# EasyEDA Pro project ProPrj_Iris One_2026-02-21.epro

# Schematic Iris One
Board Name: IrisV1.0; Create Date: 2026-02-19; Page Name: P1; Project Name: Iris One; Schematic Name: Iris One; Update Date: 2026-02-20; Company: root://workspace; Drawn: NullByte; Page Size: A4; Version: V1.0
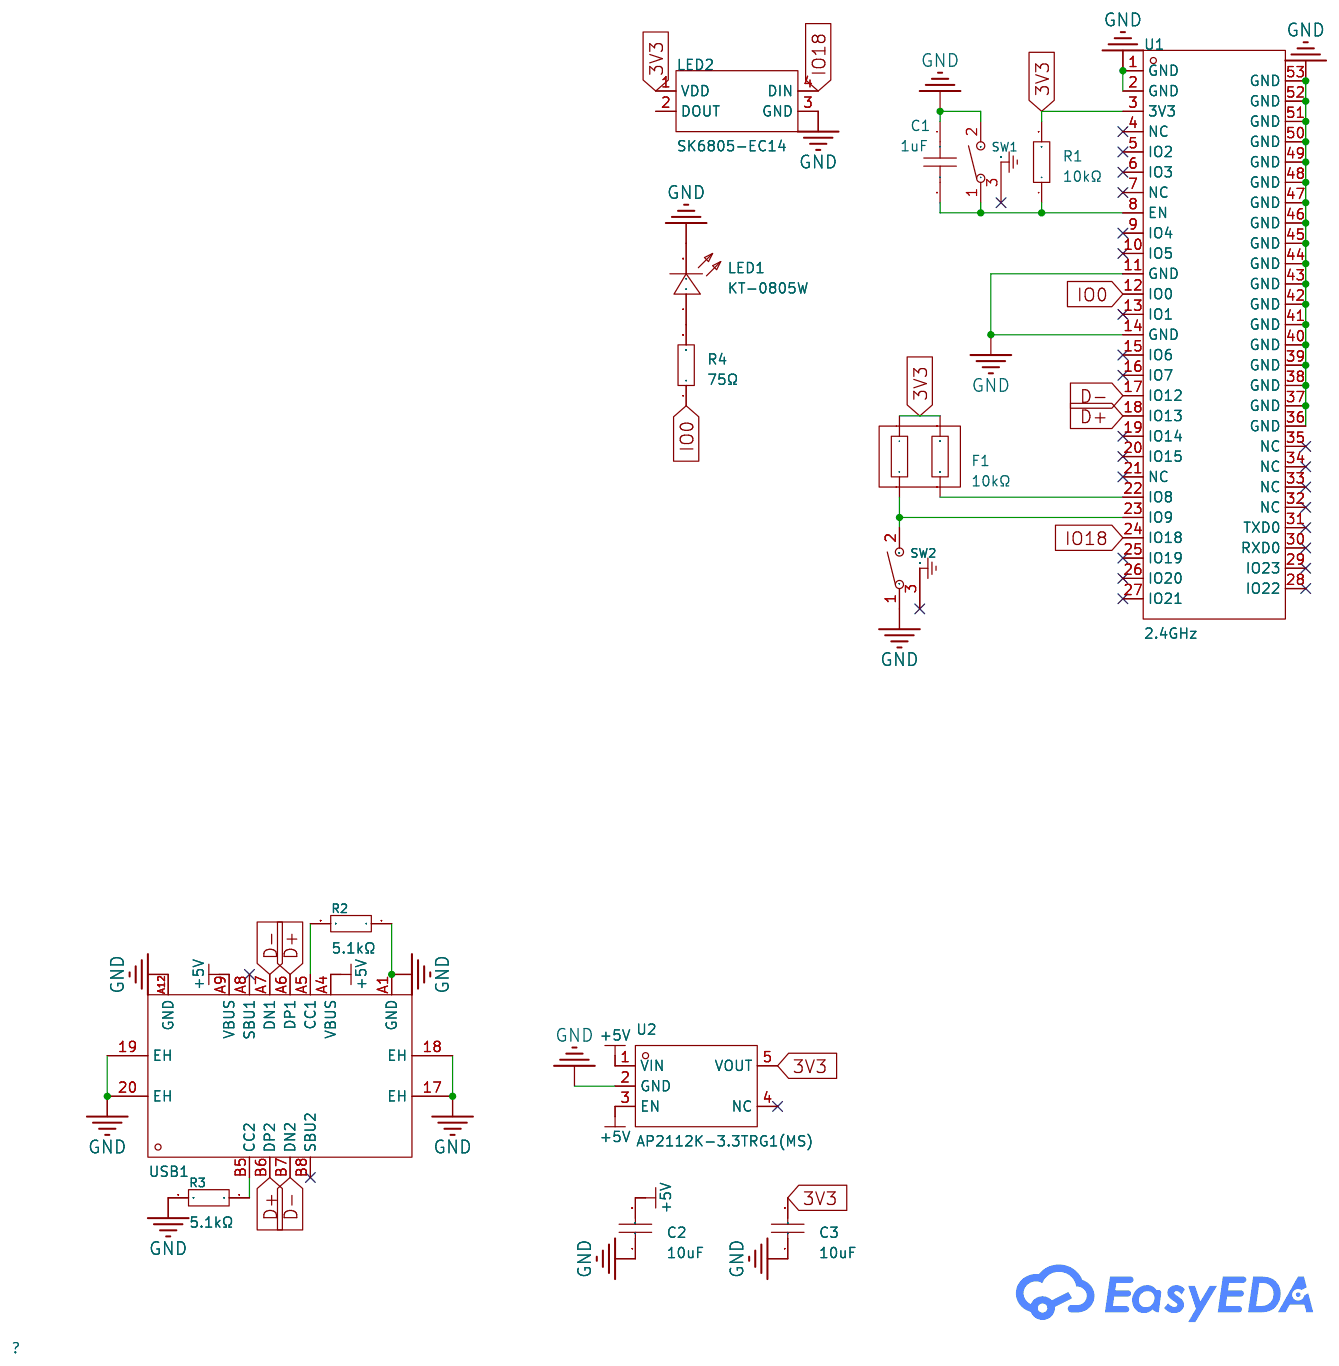
[diagram p0: schematic sheet]

## Parts
C1  1uF  [C0402]
C2  10uF  [C0402]
C3  10uF  [C0402]
F1  10kΩ  [RES-ARRAY-SMD_0404-4P-L1.0-W1.0-BL]
LED1  KT-0805W  [LED0805-R-RD]
LED2  SK6805-EC14  [LED-SMD_4P-L1.4-W1.4-TL]
R1  10kΩ  [R0402]
R2  5.1kΩ  [R0402]
R3  5.1kΩ  [R0402]
R4  75Ω  [R0402]
SW1  SKTDLHE010  [KEY-SMD_SKTDLHE010]
SW2  SKTDLHE010  [KEY-SMD_SKTDLHE010]
U1  2.4GHz  [WIFIM-SMD_61P-L16.6-W13.2-P0.80-ESP32-C6-MINI-1-N4]
U2  AP2112K-3.3TRG1(MS)  [SOT-23-5_L2.9-W1.6-P0.95-LS2.7-BR]
USB1  TYPE-C 16P QTGM027  [USB-C-SMD_TYPE-C-16P-QTGM027]

## Library data of the parts
C1 = CL05A105KA5NQNC: Capacitance:1uF Tolerance:±10% Tolerance:±10% Voltage Rating:25V Temperature Coefficient:X5R; LCSC Part Name: 1uF ±10% 25V; Supplier Part: C52923; Manufacturer: SAMSUNG(三星); Supplier Footprint: 0402; JLCPCB Part Class: Basic Part; Datasheet: https://item.szlcsc.com/datasheet/CL05A105KA5NQNC/53938.html; Supplier: LCSC; Tolerance: ±10%; Voltage Rating: 25V; Temperature Coefficient: X5R
C2 C3 = CL05A106MQ5NUNC: Capacitance:10uF Tolerance:±20% Tolerance:±20% Voltage Rating:6.3V Temperature Coefficient:X5R; LCSC Part Name: 10uF ±20% 6.3V; Supplier Part: C15525; Manufacturer: SAMSUNG(三星); Supplier Footprint: 0402; JLCPCB Part Class: Basic Part; Datasheet: https://item.szlcsc.com/datasheet/CL05A106MQ5NUNC/16204.html; Supplier: LCSC; Tolerance: ±20%; Voltage Rating: 6.3V; Temperature Coefficient: X5R
F1 = YC122-JR-0710KL: Number of Resistors: Resistance: Tolerance:±5% Tolerance:±5% Power(Watts): Temperature Coefficient:±200ppm/℃ Temperature Coefficient:±200ppm/℃ Number of Pins:; LCSC Part Name: 10kΩ ±5%; Supplier Part: C695179; Manufacturer: YAGEO(国巨); Supplier Footprint: 0402x2; JLCPCB Part Class: Extended Part; Datasheet: https://atta.szlcsc.com/upload/public/pdf/source/20200630/C695179_C01B8AD03C65079234DFC6C85CDBB06F.pdf; Supplier: LCSC; Tolerance: ±5%; Temperature Coefficient: ±200ppm/℃
LED1 = KT-0805W: LCSC Part Name: 0805 白灯 高亮; Supplier Part: C34499; Manufacturer: KENTO; Supplier Footprint: 0805; JLCPCB Part Class: Basic Part; Datasheet: https://atta.szlcsc.com/upload/public/pdf/source/20221124/DAA20402FFC1FB071B8B6797757426FE.pdf; Supplier: LCSC
LED2 = SK6805-EC14_C2909055: LCSC Part Name: RGB三色; Supplier Part: C2909055; Manufacturer: 欧思科光电; Supplier Footprint: SMD,1.4x1.4mm; JLCPCB Part Class: Extended Part; Datasheet: https://atta.szlcsc.com/upload/public/pdf/source/20220216/66E0AA6A2A862BC6ACA495BCDA772BF7.pdf; Supplier: LCSC
R1 = 0402WGF1002TCE: Type:Thick Film Resistor Resistance:10kΩ Tolerance:±1% Tolerance:±1% Power(Watts):62.5mW Voltage-Supply(Max):50V Temperature Coefficient:±100ppm/℃ Temperature Coefficient:±100ppm/℃ Operating Temperature:-55℃~+155℃ Operating Temperature:-55℃~+155℃; LCSC Part Name: 10kΩ ±1% 62.5mW 厚膜电阻; Supplier Part: C25744; Manufacturer: UNI-ROYAL(厚声); Supplier Footprint: 0402; JLCPCB Part Class: Basic Part; Datasheet: https://item.szlcsc.com/datasheet/0402WGF1002TCE/26487.html; Supplier: LCSC; Type: Thick Film Resistor; Tolerance: ±1%; Power(Watts): 62.5mW; Voltage-Supply(Max): 50V; Temperature Coefficient: ±100ppm/℃; Operating Temperature: -55℃~+155℃
R2 R3 = 0402WGF5101TCE: Type:Thick Film Resistor Resistance:5.1kΩ Tolerance:±1% Tolerance:±1% Power(Watts):62.5mW Voltage-Supply(Max):50V Temperature Coefficient:±100ppm/℃ Temperature Coefficient:±100ppm/℃ Operating Temperature:-55℃~+155℃ Operating Temperature:-55℃~+155℃; LCSC Part Name: 5.1kΩ ±1% 62.5mW 厚膜电阻; Supplier Part: C25905; Manufacturer: UNI-ROYAL(厚声); Supplier Footprint: 0402; JLCPCB Part Class: Basic Part; Datasheet: https://item.szlcsc.com/datasheet/0402WGF5101TCE/26648.html; Supplier: LCSC; Type: Thick Film Resistor; Tolerance: ±1%; Power(Watts): 62.5mW; Voltage-Supply(Max): 50V; Temperature Coefficient: ±100ppm/℃; Operating Temperature: -55℃~+155℃
R4 = 0402WGF750JTCE: Type:Thick Film Resistor Resistance:75Ω Tolerance:±1% Tolerance:±1% Power(Watts):62.5mW Voltage-Supply(Max):50V Temperature Coefficient:±100ppm/℃ Temperature Coefficient:±100ppm/℃ Operating Temperature:-55℃~+155℃ Operating Temperature:-55℃~+155℃; LCSC Part Name: 75Ω ±1% 62.5mW 厚膜电阻; Supplier Part: C25133; Manufacturer: UNI-ROYAL(厚声); Supplier Footprint: 0402; JLCPCB Part Class: Extended Part; Datasheet: https://item.szlcsc.com/datasheet/0402WGF750JTCE/25876.html; Supplier: LCSC; Type: Thick Film Resistor; Tolerance: ±1%; Power(Watts): 62.5mW; Voltage-Supply(Max): 50V; Temperature Coefficient: ±100ppm/℃; Operating Temperature: -55℃~+155℃
SW1 SW2 = SKTDLHE010: Circuit:SPST Actuator Style:Rectangle button Mounting Style:卧贴 With Lamp:- Mechanical Life:-; Supplier Part: C380198; Manufacturer: ALPSALPINE(阿尔卑斯阿尔派); Supplier Footprint: SMD; JLCPCB Part Class: Extended Part; Datasheet: https://atta.szlcsc.com/upload/public/pdf/source/20200409/C380198_178C729B1AFCBF15D3CDD9052567B65D.pdf; Supplier: LCSC; Circuit: SPST; Actuator Style: Rectangle button; Mounting Style: 卧贴
U1 = ESP32-C6-MINI-1-N4: Utilized IC / Part:ESP32-C6FH4 Interface Type:I2C；GPIO；UART；SPI；I2S Frequency:2.4GHz Antenna Type:On-board PCB Antenna Output Power:20.5dBm Output Power:20.5dBm Voltage - Supply:3V~3.6V Voltage - Supply:3V~3.6V Receive  Current:78mA Send  Current:382mA Se; Supplier Part: C5736265; Manufacturer: ESPRESSIF(乐鑫); Supplier Footprint: SMD-53P; JLCPCB Part Class: Extended Part; Datasheet: https://item.szlcsc.com/datasheet/ESP32-C6-MINI-1-N4/6661848.html; Supplier: LCSC; Utilized IC / Part: ESP32-C6FH4; Interface Type: I2C；GPIO；UART；SPI；I2S; Antenna Type: On-board PCB Antenna; Output Power: 20.5dBm; Voltage - Supply: 3V~3.6V; Receive  Current: 78mA; Send  Current: 382mA; Sensitivity: -99.2dBm; Operating Temperature: -40℃~+85℃
U2 = AP2112K-3.3TRG1(MS): Output Type:Fixed Voltage - Supply:6V Output Voltage:3.3V Output Voltage:3.3V Output Current:600mA Power Supply Rejection Ratio (PSRR):75dB@(1kHz) Voltage Dropout:- standby current:2uA Noise:- Features:Automatic Discharge Function；Low ESR；Overheat protect; Supplier Part: C22365427; Manufacturer: MSKSEMI(美森科); Supplier Footprint: SOT-23-5; JLCPCB Part Class: Extended Part; Datasheet: https://item.szlcsc.com/datasheet/AP2112K-3.3TRG1(MS)/23832169.html; Supplier: LCSC; Output Type: Fixed; Voltage - Supply: 6V; Output Voltage: 3.3V; Output Current: 600mA; Power Supply Rejection Ratio (PSRR): 75dB@(1kHz); standby current: 2uA; Features: Automatic Discharge Function；Low ESR；Overheat protection；Overcurrent Protection；With ability; Operating Temperature: -40℃~+125℃@(Tj); Output Configuration: Positive electrode; Number of Outputs: 1
USB1 = TYPE-C 16P QTGM027: Connector Type:Type-C Protocol Standard:USB 3.1 Gender:Female Mounting Type:Surface Mount, Right Angle Number of Contacts:16P Number of Ports:1 Current Rating-Power:3A Voltage Rating:20V Connect-Disconnect Life:5,000 times Detection color:Black Operating; LCSC Part Name: 16P卧贴母座; Supplier Part: C2681552; Manufacturer: SHOU HAN(首韩); Supplier Footprint: SMD; JLCPCB Part Class: Extended Part; Datasheet: https://item.szlcsc.com/datasheet/TYPE-C%252016P%2520QTGM027/2774895.html; Supplier: LCSC; Connector Type: Type-C; Protocol Standard: USB 3.1; Gender: Female; Mounting Type: Surface Mount, Right Angle; Number of Contacts: 16P; Number of Ports: 1; Current Rating-Power: 3A; Voltage Rating: 20V; Connect-Disconnect Life: 5,000 times; Detection color: Black; Operating Temperature: -30℃~+80℃

## Nets
3V3: C3.2 F1.3 F1.4 LED2.1(VDD) R1.2 U1.3(3V3) U2.5(VOUT)
+5V: C2.2 U2.1(VIN) U2.3(EN) USB1.A4(VBUS) USB1.A9(VBUS)
GND: C1.1 C2.1 C3.1 LED1.2(K) LED2.3(GND) R2.1 R3.2 SW1.2 SW2.1 U1.1(GND) U1.2(GND) U1.11(GND) U1.14(GND) U1.36(GND) U1.37(GND) U1.38(GND) U1.39(GND) U1.40(GND) U1.41(GND) U1.42(GND) U1.43(GND) U1.44(GND) U1.45(GND) U1.46(GND) U1.47(GND) U1.48(GND) U1.49(GND) U1.50(GND) U1.51(GND) U1.52(GND) U1.53(GND) U2.2(GND) USB1.17(EH) USB1.18(EH) USB1.19(EH) USB1.20(EH) USB1.A1(GND) USB1.A12(GND)
D+: U1.18(IO13) USB1.A6(DP1) USB1.B6(DP2)
D-: U1.17(IO12) USB1.A7(DN1) USB1.B7(DN2)
IO0: R4.1 U1.12(IO0)
IO18: LED2.4(DIN) U1.24(IO18)
$1N9305: F1.2 U1.22(IO8)
$1N9321: F1.1 SW2.2 U1.23(IO9)
$1N9412: C1.2 R1.1 SW1.1 U1.8(EN)
$1N11906: R3.1 USB1.B5(CC2)
$1N11910: R2.2 USB1.A5(CC1)
$1N12514: LED1.1(A) R4.2

Not connected (* = marked no-connect by the designer): LED2 2(DOUT); SW1 3(GND)*; SW2 3(GND)*; U1 4(NC)* 5(IO2)* 6(IO3)* 7(NC)* 9(IO4)* 10(IO5)* 13(IO1)* 15(IO6)* 16(IO7)* 19(IO14)* 20(IO15)* 21(NC)* 25(IO19)* 26(IO20)* 27(IO21)* 28(IO22)* 29(IO23)* 30(RXD0)* 31(TXD0)* 32(NC)* 33(NC)* 34(NC)* 35(NC)*; U2 4(NC)*; USB1 A8(SBU1)* B8(SBU2)*

# Board PCB1
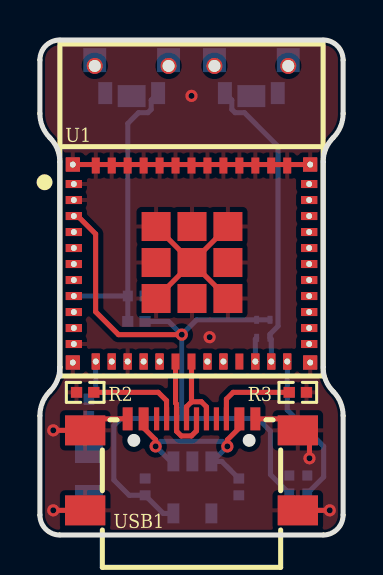
[diagram p1: board, top side]
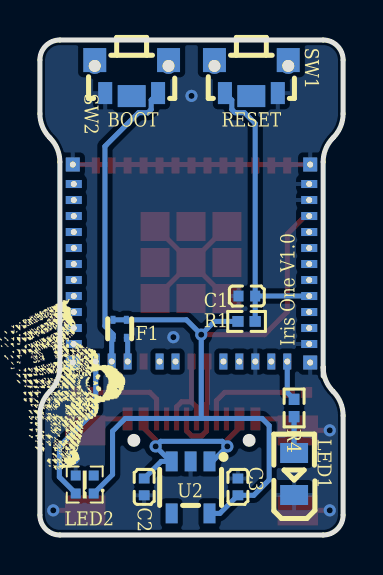
[diagram p2: board, bottom side, seen from below]

Outline 15.2 x 24.75 mm; copper layers: Top Layer, Bottom Layer. Coordinates in mm from the lower left corner of the outline.
Outline path: 1,8.39 arc(0.87,7.73) 0.5,7.18 arc(0.13,6.63) 0,5.97 0,1 arc(0.29,0.29) 1,0 14.2,0 arc(14.91,0.29) 15.2,1 15.2,5.97 arc(15.07,6.63) 14.7,7.18 arc(14.33,7.73) 14.2,8.39 14.2,18.66 arc(14.33,19.31) 14.7,19.86 arc(15.07,20.42) 15.2,21.07 15.2,23.75 arc(14.91,24.46) 14.2,24.75 1,24.75 arc(0.29,24.46) 0,23.75 0,21.07 arc(0.13,20.42) 0.5,19.86 arc(0.87,19.31) 1,18.66 1,8.39 ; 1,8.39 1,7.95
Stack: Top Layer 0.035mm / Dielectric1 1.51mm FR4 er 4.5 / Bottom Layer 0.035mm

## Design rules (mm)
template: JLCPCB Capability(Two Layers Board)
spacing copperThickness1oz (default): track to track 0.102, other pairs 0.152 to 0.3
spacing copperThickness2oz: track to track 0.203, other pairs 0.152 to 0.3
track width copperThickness1oz (default): min 0.127, default 0.254, max 2.54
track width copperThickness2oz: min 0.203, default 0.254, max 2.54
differential pair differentialPair (default): width min 0.127, default 0.254, max 2.54; gap min 0.152, default 0.152
via viaSize (default): diameter min 0.5, default 0.61, max 10; hole min 0.3, default 0.305, max 6.3

## Placement (name value [footprint] x y rotation side)
C1  1uF  [C0402]  4.83 11.95 180 bottom
C2  10uF  [C0402]  9.97 2.41 90 bottom
C3  10uF  [C0402]  5.27 2.41 270 bottom
F1  10kΩ  [RES-ARRAY-SMD_0404-4P-L1.0-W1.0-BL]  11.2 10.31 180 bottom
LED1  KT-0805W  [LED0805-R-RD]  2.46 3.05 90 bottom
LED2  SK6805-EC14  [LED-SMD_4P-L1.4-W1.4-TL]  12.95 2.53 0 bottom
NOREF  -  [Pad_e155]  3.6 8.67 90 top
NOREF#2  -  [Pad_e128]  1.7 12.75 0 top
NOREF#3  -  [Pad_e136]  13.5 15.15 0 top
NOREF#4  -  [Pad_e504]  13.55 8.62 0 top
NOREF#5  -  [Pad_e133]  13.5 17.55 0 top
NOREF#6  -  [Pad_e125]  1.7 15.15 0 top
NOREF#7  -  [Pad_e141]  13.5 11.15 0 top
NOREF#8  -  [Pad_e137]  13.5 14.35 0 top
NOREF#9  -  [Pad_e154]  4.4 8.67 90 top
NOREF#10  -  [Pad_e122]  1.7 17.55 0 top
NOREF#11  -  [Pad_e134]  13.5 16.75 0 top
NOREF#12  -  [Pad_e149]  8.4 8.67 90 top
NOREF#13  -  [Pad_e505]  1.65 8.62 0 top
NOREF#14  -  [Pad_e123]  1.7 16.75 0 top
NOREF#15  -  [Pad_e153]  5.2 8.67 90 top
NOREF#16  -  [Pad_e143]  13.5 9.55 0 top
NOREF#17  -  [Pad_e126]  1.7 14.35 0 top
NOREF#18  -  [Pad_e124]  1.7 15.95 0 top
NOREF#19  -  [Pad_e507]  13.55 18.52 0 top
NOREF#20  -  [Pad_e132]  1.7 9.55 0 top
NOREF#21  -  [Pad_e152]  6 8.67 90 top
NOREF#22  -  [Pad_e127]  1.7 13.55 0 top
NOREF#23  -  [Pad_e146]  11.6 8.67 270 top
NOREF#24  -  [Pad_e130]  1.7 11.15 0 top
NOREF#25  -  [Pad_e147]  10.8 8.67 90 top
NOREF#26  -  [Pad_e131]  1.7 10.35 0 top
NOREF#27  -  [Pad_e142]  13.5 10.35 0 top
NOREF#28  -  [Pad_e140]  13.5 11.95 0 top
NOREF#29  -  [Pad_e138]  13.5 13.55 0 top
NOREF#30  -  [Pad_e508]  1.65 18.52 0 top
NOREF#31  -  [Pad_e156]  2.8 8.67 90 top
NOREF#32  -  [Pad_e148]  9.2 8.67 90 top
NOREF#33  -  [Pad_e129]  1.7 11.95 0 top
NOREF#34  -  [Pad_e145]  12.4 8.67 90 top
NOREF#35  -  [Pad_e139]  13.5 12.75 0 top
NOREF#36  -  [Pad_e135]  13.5 15.95 0 top
R1  10kΩ  [R0402]  4.84 10.68 0 bottom
R2  5.1kΩ  [R0402]  2.27 7.13 0 top
R3  5.1kΩ  [R0402]  12.93 7.13 0 top
R4  75Ω  [R0402]  2.46 6.35 270 bottom
SW1  SKTDLHE010  [KEY-SMD_SKTDLHE010]  4.6 22.84 180 bottom
SW2  SKTDLHE010  [KEY-SMD_SKTDLHE010]  10.6 22.84 180 bottom
U1  2.4GHz  [WIFIM-SMD_61P-L16.6-W13.2-P0.80-ESP32-C6-MINI-1-N4]  7.6 13.57 0 top
U2  AP2112K-3.3TRG1(MS)  [SOT-23-5_L2.9-W1.6-P0.95-LS2.7-BR]  7.65 2.38 90 bottom
USB1  TYPE-C 16P QTGM027  [USB-C-SMD_TYPE-C-16P-QTGM027]  7.6 3.52 0 top

## Footprints (pads in the part's own frame, mm; a bottom-side part is the same pattern mirrored in y, then rotated)
C0402
  rect 0.5x0.54 smd: 1(-0.42,0) 2(0.42,0)
KEY-SMD_SKTDLHE010
  rect 0.7x1.1 smd: 1(-1.325,-0.75) 2(1.325,-0.75)
  round 0.8 hole 0.6: 3(-1.85,0.608) 3(1.85,0.608)
  rect 1.15x1.2 smd: 3(-1.85,0.9) 3(1.85,0.9)
  rect 1.4x1.1 smd: 3(0,-0.9)
LED0805-R-RD
  rect 1x1.399 smd: 1(1.05,0) 2(-1.05,0)
LED-SMD_4P-L1.4-W1.4-TL
  rect 0.5x0.5 smd: 1(-0.45,0.45) 2(-0.45,-0.45) 3(0.45,-0.45) 4(0.45,0.45)
Pad_e122
  rect 0.8x0.4 hole 0.3: 1(0,0)
Pad_e123
  rect 0.8x0.4 hole 0.3: 1(0,0)
Pad_e124
  rect 0.8x0.4 hole 0.3: 1(0,0)
Pad_e125
  rect 0.8x0.4 hole 0.3: 1(0,0)
Pad_e126
  rect 0.8x0.4 hole 0.3: 1(0,0)
Pad_e127
  rect 0.8x0.4 hole 0.3: 1(0,0)
Pad_e128
  rect 0.8x0.4 hole 0.3: 1(0,0)
Pad_e129
  rect 0.8x0.4 hole 0.3: 1(0,0)
Pad_e130
  rect 0.8x0.4 hole 0.3: 1(0,0)
Pad_e131
  rect 0.8x0.4 hole 0.3: 1(0,0)
Pad_e132
  rect 0.8x0.4 hole 0.3: 1(0,0)
Pad_e133
  rect 0.8x0.4 hole 0.3: 1(0,0)
Pad_e134
  rect 0.8x0.4 hole 0.3: 1(0,0)
Pad_e135
  rect 0.8x0.4 hole 0.3: 1(0,0)
Pad_e136
  rect 0.8x0.4 hole 0.3: 1(0,0)
Pad_e137
  rect 0.8x0.4 hole 0.3: 1(0,0)
Pad_e138
  rect 0.8x0.4 hole 0.3: 1(0,0)
Pad_e139
  rect 0.8x0.4 hole 0.3: 1(0,0)
Pad_e140
  rect 0.8x0.4 hole 0.3: 1(0,0)
Pad_e141
  rect 0.8x0.4 hole 0.3: 1(0,0)
Pad_e142
  rect 0.8x0.4 hole 0.3: 1(0,0)
Pad_e143
  rect 0.8x0.4 hole 0.3: 1(0,0)
Pad_e145
  rect 0.8x0.4 hole 0.3: 1(0,0)
Pad_e146
  rect 0.8x0.4 hole 0.3: 1(0,0)
Pad_e147
  rect 0.8x0.4 hole 0.3: 1(0,0)
Pad_e148
  rect 0.8x0.4 hole 0.3: 1(0,0)
Pad_e149
  rect 0.8x0.4 hole 0.3: 1(0,0)
Pad_e152
  rect 0.8x0.4 hole 0.3: 1(0,0)
Pad_e153
  rect 0.8x0.4 hole 0.3: 1(0,0)
Pad_e154
  rect 0.8x0.4 hole 0.3: 1(0,0)
Pad_e155
  rect 0.8x0.4 hole 0.3: 1(0,0)
Pad_e156
  rect 0.8x0.4 hole 0.3: 1(0,0)
Pad_e504
  rect 0.7x0.7 hole 0.3: 1(0,0)
Pad_e505
  rect 0.7x0.7 hole 0.3: 1(0,0)
Pad_e507
  rect 0.7x0.7 hole 0.3: 1(0,0)
Pad_e508
  rect 0.7x0.7 hole 0.3: 1(0,0)
R0402
  rect 0.566x0.54 smd: 1(-0.433,0) 2(0.433,0)
RES-ARRAY-SMD_0404-4P-L1.0-W1.0-BL
  rect 0.25x0.4 smd: 1(-0.335,-0.45) 2(0.335,-0.45) 3(0.335,0.45) 4(-0.335,0.45)
SOT-23-5_L2.9-W1.6-P0.95-LS2.7-BR
  rect 1x0.6 smd: 1(1.3,-0.95) 2(1.3,0) 3(1.3,0.95) 4(-1.3,0.95) 5(-1.3,-0.95)
USB-C-SMD_TYPE-C-16P-QTGM027
  rect 2.02x1.5 smd: 17(5.33,1.712) 18(5.33,-2.288) 19(-5.33,-2.288) 20(-5.33,1.712)
  rect 0.5x1.15 smd: A1(-3.2,2.288) A4(-2.4,2.288) A9(2.4,2.288) A12(3.2,2.288)
  rect 0.26x1.15 smd: A5(-1.25,2.288) A6(-0.25,2.288) A7(0.25,2.288) A8(1.25,2.288) B5(1.75,2.288) B6(0.75,2.288) B7(-0.75,2.288) B8(-1.75,2.288)
WIFIM-SMD_61P-L16.6-W13.2-P0.80-ESP32-C6-MINI-1-N4
  rect 0.8x0.4 smd: 1(-5.9,3.975) 2(-5.9,3.175) 3(-5.9,2.375) 4(-5.9,1.575) 5(-5.9,0.775) 6(-5.9,-0.025) 7(-5.9,-0.825) 8(-5.9,-1.625) 9(-5.9,-2.425) 10(-5.9,-3.225) 11(-5.9,-4.025) 25(5.9,-4.025) 26(5.9,-3.225) 27(5.9,-2.425) 28(5.9,-1.625) 29(5.9,-0.825) 30(5.9,-0.025) 31(5.9,0.775) 32(5.9,1.575) 33(5.9,2.375) 34(5.9,3.175) 35(5.9,3.975)
  rect 0.4x0.8 smd: 12(-4.8,-4.9) 13(-4,-4.9) 14(-3.2,-4.9) 15(-2.4,-4.9) 16(-1.6,-4.9) 17(-0.8,-4.9) 18(0,-4.9) 19(0.8,-4.9) 20(1.6,-4.9) 21(2.4,-4.9) 22(3.2,-4.9) 23(4,-4.9) 24(4.8,-4.9) 36(4.8,4.9) 37(4,4.9) 38(3.2,4.9) 39(2.4,4.9) 40(1.6,4.9) 41(0.8,4.9) 42(0,4.9) 43(-0.8,4.9) 44(-1.6,4.9) 45(-2.4,4.9) 46(-3.2,4.9) 47(-4,4.9) 48(-4.8,4.9)
  rect 1.45x1.45 smd: 49(-1.775,1.85) 49(-1.775,0.05) 49(-1.775,-1.75) 49(0.025,1.85) 49(0.025,0.05) 49(0.025,-1.75) 49(1.825,1.85) 49(1.825,0.05) 49(1.825,-1.75)
  rect 0.7x0.7 smd: 50(5.95,4.95) 51(5.95,-4.95) 52(-5.95,-4.95) 53(-5.95,4.95)

## Nets
3V3: C3.2 F1.3 F1.4 LED2.1 NOREF#18.1 R1.2 U1.3 U2.5
+5V: C2.2 U2.1 U2.3 USB1.A4 USB1.A9
GND: C1.1 C2.1 C3.1 LED1.2 LED2.3 NOREF#4.1 NOREF#9.1 NOREF#10.1 NOREF#13.1 NOREF#14.1 NOREF#19.1 NOREF#20.1 NOREF#30.1 R2.1 R3.2 SW1.2 SW2.1 U1.1 U1.2 U1.11 U1.14 U1.36 U1.37 U1.38 U1.39 U1.40 U1.41 U1.42 U1.43 U1.44 U1.45 U1.46 U1.47 U1.48 U1.49 U1.50 U1.51 U1.52 U1.53 U2.2 USB1.17 USB1.18 USB1.19 USB1.20 USB1.A1 USB1.A12
D+: U1.18 USB1.A6 USB1.B6
D-: U1.17 USB1.A7 USB1.B7
IO0: NOREF#31.1 R4.1 U1.12
IO18: LED2.4 NOREF#34.1 U1.24
$1N9305: F1.2 NOREF#25.1 U1.22
$1N9321: F1.1 NOREF#23.1 SW2.2 U1.23
$1N9412: C1.2 NOREF#33.1 R1.1 SW1.1 U1.8
$1N11906: R3.1 USB1.B5
$1N11910: R2.2 USB1.A5
$1N12514: LED1.1 R4.2

Pads without a net: LED2 2; NOREF 1; NOREF#2 1; NOREF#3 1; NOREF#5 1; NOREF#6 1; NOREF#7 1; NOREF#8 1; NOREF#11 1; NOREF#12 1; NOREF#15 1; NOREF#16 1; NOREF#17 1; NOREF#21 1; NOREF#22 1; NOREF#24 1; NOREF#26 1; NOREF#27 1; NOREF#28 1; NOREF#29 1; NOREF#32 1; NOREF#35 1; NOREF#36 1; SW1 3; SW2 3; U1 4 5 6 7 9 10 13 15 16 19 20 21 25 26 27 28 29 30 31 32 33 34 35; U2 4; USB1 A8 B8

## Via types
v1: diameter 0.61, hole 0.305, Top Layer to Bottom Layer, 9 vias

## Routing (per net, layer and track width the routed paths; a pad name or vN(x,y) marks a point on that pad's centre or on a via; arc(x,y) is an arc through that point)
3V3: length 39.3
  Top Layer w0.254: v1(7.11,10.02) 3.94,10.02 2.79,11.16 2.79,15.05 1.89,15.95 NOREF#18.1
  Bottom Layer w0.254: v1(7.11,10.02) 7.85,10.76 F1.3 F1.4 ; v1(7.11,10.02) 7.11,5.83 ; v1(7.11,10.02) 6.45,10.68 R1.2 ; 7.11,5.83 4.06,5.83 3.71,5.47 3.71,2.75 4.48,1.98 C3.2 6.18,1.08 U2.5 ; 7.11,5.83 10.92,5.83 11.56,5.19 11.56,3.02 LED2.1
+5V: length 11.1
  Top Layer w0.254: v1(9.4,4.43) 9.4,4.76 10,5.36 USB1.A9 ; USB1.A4 5.2,5.36 5.8,4.76 v1(5.8,4.43)
  Bottom Layer w0.254: 8.65,3.68 v1(9.4,4.43) 9.14,4.68 6.06,4.68 v1(5.8,4.43) 6.55,3.68 U2.1 ; 8.65,3.68 U2.3 ; 8.65,3.68 9.12,3.68 C2.2
GND: length 33.3
  Top Layer w0.254: v1(13.51,3.84) 13.51,4.65 USB1.17 12.36,5.81 USB1.A12 ; U1.49 U1.49 ; U1.49 U1.49 ; U1.49 U1.49 ; U1.49 U1.49 ; v1(0.67,5.23) USB1.20 2.84,5.81 USB1.A1 ; NOREF#19.1 U1.53 ; USB1.19 v1(0.67,1.23) ; USB1.18 v1(14.53,1.23)
  vias: v1(7.6,21.96) v1(8.51,9.89)
D+: length 4.4
  Top Layer w0.254: USB1.A6 7.35,6.41 7.6,6.66 ; 7.6,6.66 7.6,6.66 8.1,6.66 8.35,6.41 USB1.B6 ; 7.6,6.66 U1.18
D-: length 5.3
  Top Layer w0.254: USB1.A7 7.85,5.21 7.6,4.95 7.09,4.95 6.85,5.19 USB1.B7 6.85,6.55 6.8,6.6 U1.17
IO0: length 2
  Bottom Layer w0.254: R4.1 2.8,7.13 U1.12
IO18: length 7.7
  Bottom Layer w0.254: U1.24 12.4,6.25 14.22,4.43 14.22,2.9 13.4,2.08 LED2.4
$1N9305: length 1.2
  Bottom Layer w0.254: 10.87,9.86 10.8,9.79 U1.22
$1N9321: length 15
  Bottom Layer w0.254: U1.23 11.6,9.79 11.53,9.86 11.53,10.04 11.94,10.44 11.94,19.43 10.25,21.12 9.78,21.12 9.62,21.28 9.62,21.75 SW2.2
$1N9412: length 15
  Bottom Layer w0.254: C1.2 R1.1 ; C1.2 U1.8 ; C1.2 4.41,20.58 4.95,21.12 5.42,21.12 5.58,21.28 5.58,21.75 SW1.1
$1N11906: length 4.3
  Top Layer w0.254: R3.1 9.69,7.13 9.35,6.8 USB1.B5
$1N11910: length 4.7
  Top Layer w0.254: USB1.A5 6.35,6.72 5.93,7.13 R2.2
$1N12514: length 1.8
  Bottom Layer w0.254: R4.2 LED1.1

## Copper pours and planes (outline as drawn; the poured copper is in the pictures)
GND on Top Layer: -2.41,26.91 17.53,26.91 17.53,-1.92 -2.41,-1.92
GND on Bottom Layer: -2.03,26.15 16.51,26.15 16.51,-1.92 -2.03,-1.92

## Text on the board
Bottom Silkscreen Layer: RESET | BOOT | Iris One V1.0
